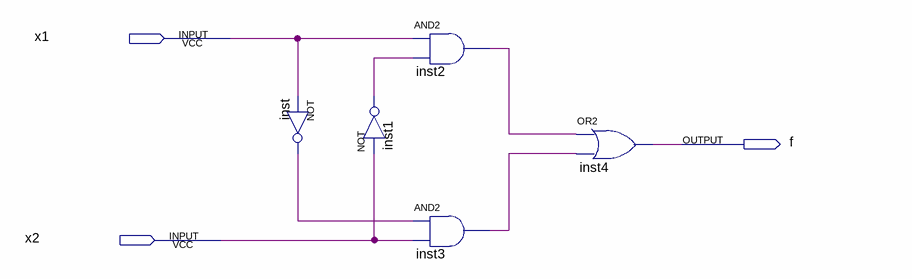
[diagram p0: schematic sheet]
// Quartus schematic light.bdf as structural Verilog: 5 symbols, 3 pins
module light (
  input  x1,
  input  x2,
  output f
);

  wire inst1_out, inst2_out, inst3_out, inst_out;

  not inst (inst_out, x1);
  not inst1 (inst1_out, x2);
  and inst2 (inst2_out, x1, inst1_out);
  and inst3 (inst3_out, inst_out, x2);
  or inst4 (f, inst2_out, inst3_out);
endmodule
